# EAGLE schematic manual stm (4) (EAGLE 9.2.2)
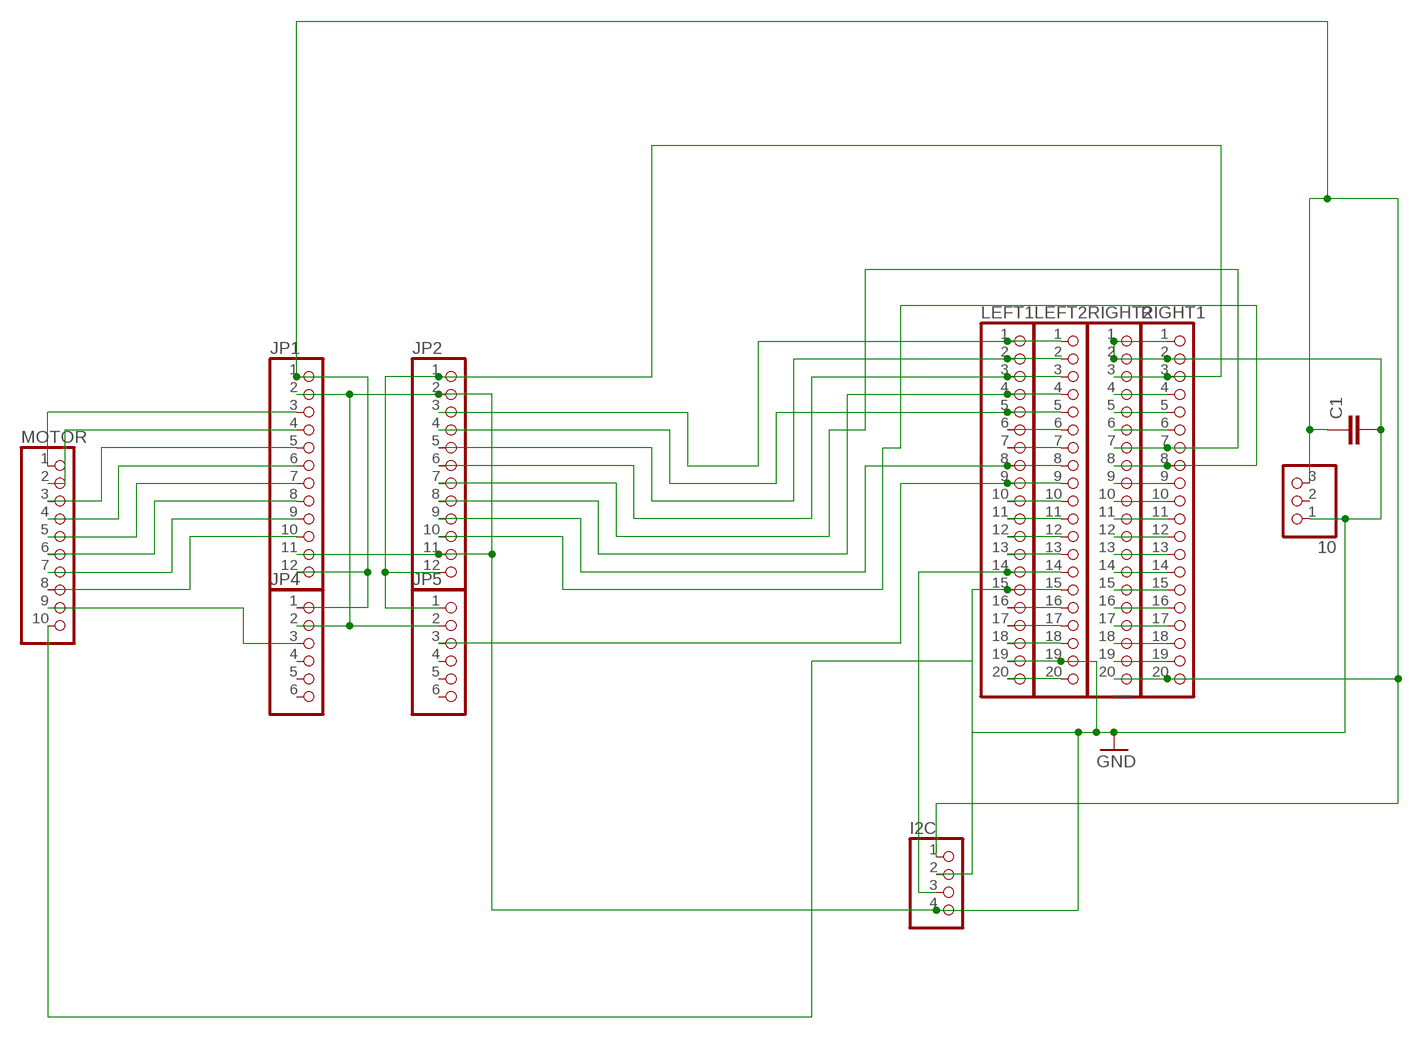
[diagram p0: schematic, sheet 1]

## Parts
10  PINHD-1X3  [1X03]
C1  C-EU075-032X103  [C075-032X103]
I2C  PINHD-1X4  [1X04]
JP1  PINHD-1X12  [1X12]
JP2  PINHD-1X12  [1X12]
JP4  PINHD-1X6  [1X06]
JP5  PINHD-1X6  [1X06]
LEFT1  PINHD-1X20  [1X20]
LEFT2  PINHD-1X20  [1X20]
MOTOR  PINHD-1X10  [1X10]
RIGHT1  PINHD-1X20  [1X20]
RIGHT2  PINHD-1X20  [1X20]

## Nets
ENCODER4: RIGHT1.4 RIGHT2.4
GND: 10.1 C1.2 I2C.4 JP1.2 JP1.11 JP2.2 JP2.11 JP4.2 JP5.2 LEFT1.19 LEFT2.19 MOTOR.10 RIGHT1.1 RIGHT1.2 RIGHT2.1 RIGHT2.2
N$1: RIGHT1.5 RIGHT2.5
N$2: LEFT1.6 LEFT2.6
N$3: JP1.3 MOTOR.1
N$4: JP2.3 LEFT1.1 LEFT2.1
N$5: JP2.5 LEFT1.2 LEFT2.2
N$6: JP2.6 LEFT1.3 LEFT2.3
N$7: JP2.8 LEFT1.4 LEFT2.4
N$8: JP2.4 LEFT1.5 LEFT2.5
N$9: RIGHT1.10 RIGHT2.10
N$10: RIGHT1.9 RIGHT2.9
N$11: JP2.9 LEFT1.8 LEFT2.8
N$12: JP5.3 LEFT1.9 LEFT2.9
N$13: LEFT1.10 LEFT2.10
N$14: LEFT1.11 LEFT2.11
N$15: RIGHT1.19 RIGHT2.19
N$16: RIGHT1.18 RIGHT2.18
N$17: RIGHT1.17 RIGHT2.17
N$18: RIGHT1.14 RIGHT2.14
N$19: RIGHT1.15 RIGHT2.15
N$20: RIGHT1.16 RIGHT2.16
N$21: LEFT1.12 LEFT2.12
N$22: RIGHT1.13 RIGHT2.13
N$23: LEFT1.17 LEFT2.17
N$24: LEFT1.16 LEFT2.16
N$25: I2C.2 LEFT1.15 LEFT2.15
N$26: JP2.7 RIGHT1.7 RIGHT2.7
N$27: JP1.4 MOTOR.2
N$29: JP2.1 JP2.12 JP5.1 RIGHT1.3 RIGHT2.3
N$30: I2C.3 LEFT1.14 LEFT2.14
N$31: JP2.10 RIGHT1.8 RIGHT2.8
N$32: RIGHT1.11 RIGHT2.11
N$33: RIGHT1.12 RIGHT2.12
N$34: LEFT1.13 LEFT2.13
N$38: LEFT1.18 LEFT2.18
N$40: JP1.5 MOTOR.3
N$41: JP1.6 MOTOR.4
N$42: JP1.7 MOTOR.5
N$43: JP1.8 MOTOR.6
N$44: JP1.9 MOTOR.7
N$45: JP1.10 MOTOR.8
N$46: JP4.3 MOTOR.9
N$47: RIGHT1.6 RIGHT2.6
N$48: 10.3 C1.1 I2C.1 JP1.1 JP1.12 JP4.1 RIGHT1.20 RIGHT2.20
N$50: LEFT1.7 LEFT2.7
N$51: LEFT1.20 LEFT2.20
Unconnected: 10.2 JP4.4 JP4.5 JP4.6 JP5.4 JP5.5 JP5.6

## Library data of the parts
10 = pinhead:PINHD-1X3: PIN HEADER
C1 = resistor:C-EU: CAPACITOR, European symbol
I2C = pinhead:PINHD-1X4: PIN HEADER
JP1 JP2 = pinhead:PINHD-1X12: PIN HEADER
JP4 JP5 = pinhead:PINHD-1X6: PIN HEADER
LEFT1 LEFT2 RIGHT1 RIGHT2 = pinhead:PINHD-1X20: PIN HEADER
MOTOR = pinhead:PINHD-1X10: PIN HEADER